# EAGLE design beemos-master (EAGLE 9.1.0)
DELETE: MF
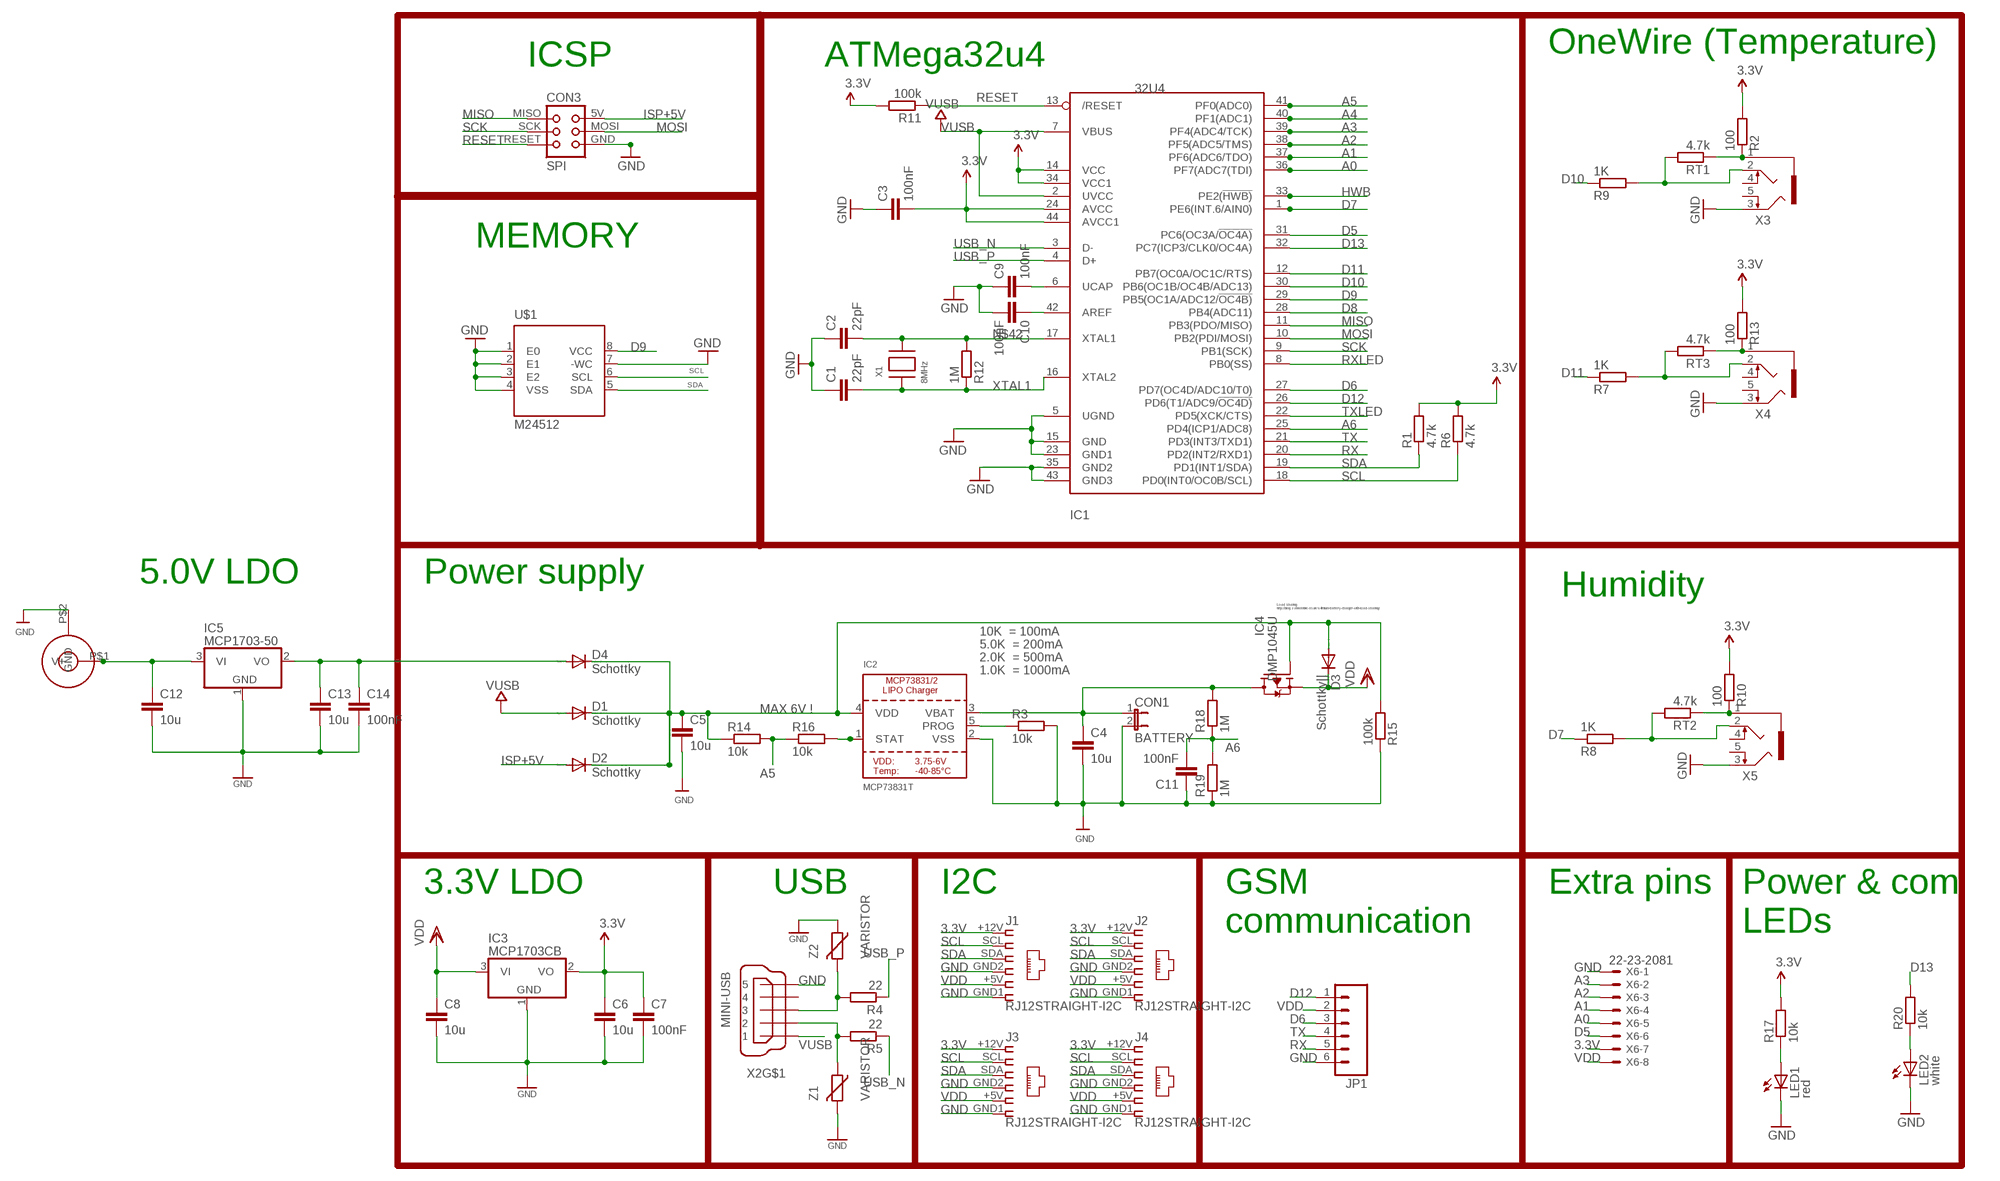
[diagram p0: schematic, sheet 1]

## Parts
C1  22pF  C-EUC0805K  [C0805K]
C2  22pF  C-EUC0805K  [C0805K]
C3  100nF  C-EUC0805K  [C0805K]
C4  10u  C-EUC0805K  [C0805K]
C5  10u  C-EUC0805K  [C0805K]
C6  10u  C-EUC0805K  [C0805K]
C7  100nF  C-EUC0805K  [C0805K]
C8  10u  C-EUC0805K  [C0805K]
C9  100nF  C-EUC0805K  [C0805K]
C10  100nF  C-EUC0805K  [C0805K]
C11  100nF  C-EUC0805K  [C0805K]
C12  10u  C-EUC0805K  [C0805K]
C13  10u  C-EUC0805K  [C0805K]
C14  100nF  C-EUC0805K  [C0805K]
CON1  BATTERY  JP1E  [JP1]
CON2  JACK_DC_BARREL  [DC_BARREL]
CON3  SPI  TINYISPT  [TC2030-MCP-NL]
D1  Schottky  MBR0520LT  [SOD123]
D2  Schottky  MBR0520LT  [SOD123]
D3  Schottky||  MBR0520LT  [SOD123]
D4  Schottky  MBR0520LT  [SOD123]
IC1  32U4  ATMEGA32U4-AU  [TQFP44]
IC2  MCP73831T  MCP73831/2  [SOT23-5]
IC3  MCP1703CB  [SOT23]
IC4  DMP1045U  TRANSISTOR_FET_TSM2301CX  [SOT-23]
IC5  MCP1703-50  MCP1703CB  [SOT23]
J1  RJ12STRAIGHT-I2C  [RJ12-STRAIGHT-I2C]
J2  RJ12STRAIGHT-I2C  [RJ12-STRAIGHT-I2C]
J3  RJ12STRAIGHT-I2C  [RJ12-STRAIGHT-I2C]
J4  RJ12STRAIGHT-I2C  [RJ12-STRAIGHT-I2C]
JP1  M06RA  [MOLEX-1X6-RA]
LED1  red  LEDCHIP-LED0805  [CHIP-LED0805]
LED2  white  LEDCHIP-LED0805  [CHIP-LED0805]
R1  4.7k  R-EU_R0805  [R0805]
R2  100  R-EU_R0805  [R0805]
R3  10k  R-EU_R0805  [R0805]
R4  22  R-EU_R0805  [R0805]
R5  22  R-EU_R0805  [R0805]
R6  4.7k  R-EU_R0805  [R0805]
R7  1K  R-EU_R0805  [R0805]
R8  1K  R-EU_R0805  [R0805]
R9  1K  R-EU_R0805  [R0805]
R10  100  R-EU_R0805  [R0805]
R11  100k  R-EU_R0805  [R0805]
R12  1M  R-EU_R0805  [R0805]
R13  100  R-EU_R0805  [R0805]
R14  10k  R-EU_R0805  [R0805]
R15  100k  R-EU_R0805  [R0805]
R16  10k  R-EU_R0805  [R0805]
R17  10k  R-EU_R0805  [R0805]
R18  1M  R-EU_R0805  [R0805]
R19  1M  R-EU_R0805  [R0805]
R20  10k  R-EU_R0805  [R0805]
RT1  4.7k  R-EU_R0805  [R0805]
RT2  4.7k  R-EU_R0805  [R0805]
RT3  4.7k  R-EU_R0805  [R0805]
U$1  M24512  [SO8]
X1  8MHz  XTALNX6035  [NX6035]
X2  MINI-USB  MINI-USB-SCHIELD-32005-201  [32005-201]
X3  1503_09  [1503_09]
X4  1503_09  [1503_09]
X5  1503_09  [1503_09]
X6  22-23-2081  [22-23-2081]
Z1  VARISTOR  VARISTORCN0805  [CT/CN0805]
Z2  VARISTOR  VARISTORCN0805  [CT/CN0805]

## Nets
3.3V [power]: C3.2 C6.1 C7.1 IC1.14(VCC) IC1.24(AVCC) IC1.34(VCC1) IC1.44(AVCC1) IC3.2(VO) J1.+12V J2.+12V J3.+12V J4.+12V R1.2 R2.2 R6.2 R10.2 R11.2 R13.2 R17.2 X6.7
A0: IC1.36(PF7(ADC7(TDI)) X6.5
A1: IC1.37(PF6(ADC6/TDO)) X6.4
A2: IC1.38(PF5(ADC5/TMS)) X6.3
A3: IC1.39(PF4(ADC4/TCK)) X6.2
A4: IC1.40(PF1(ADC1))
A5: IC1.41(PF0(ADC0)) R14.2 R16.1
A6: C11.2 IC1.25(PD4(ICP1/ADC8)) R18.1 R19.2
AREF: C10.1 IC1.42(AREF)
D5: IC1.31(PC6(OC3A/!OC4A)) X6.6
D6: IC1.27(PD7(OC4D/ADC10/T0)) JP1.3
D7: IC1.1(PE6(INT.6/AIN0)) R8.1
D8: IC1.28(PB4(ADC11))
D9: IC1.29(PB5(OC1A/ADC12/!OC4B)) U$1.8(VCC)
D10: IC1.30(PB6(OC1B/OC4B/ADC13)) R9.1
D11: IC1.12(PB7(OC0A/OC1C/RTS)) R7.1
D12: IC1.26(PD6(T1/ADC9/!OC4D)) JP1.1
D13: IC1.32(PC7(ICP3/CLK0/OC4A)) R20.2
GND [power]: C1.1 C2.1 C3.1 C4.2 C5.2 C6.2 C7.2 C8.2 C9.1 C10.2 C11.1 C12.2 C13.2 C14.2 CON1.2 CON2.P$2(GND) CON3.GND IC1.5(UGND) IC1.15(GND) IC1.23(GND1) IC1.35(GND2) IC1.43(GND3) IC2.2(VSS) IC3.1(GND) IC5.1(GND) J1.GND1 J1.GND2 J2.GND1 J2.GND2 J3.GND1 J3.GND2 J4.GND1 J4.GND2 JP1.6 LED1.C LED2.C R3.2 R15.1 R19.1 U$1.1(E0) U$1.2(E1) U$1.3(E2) U$1.4(VSS) U$1.7(-WC) X2.5 X3.3 X4.3 X5.3 X6.1 Z1.2 Z2.1
HWB: IC1.33(PE2(!HWB))
ISP+5V: CON3.5V(VCC) D2.A
MISO: CON3.MISO IC1.11(PB3(PDO/MISO))
MOSI: CON3.MOSI IC1.10(PB2(PDI/MOSI))
N$1: C9.2 IC1.6(UCAP)
N$2 [power]: R7.2 RT3.2 X4.2
N$3: C13.1 C14.1 D4.A IC5.2(VO)
N$4 [power]: R13.1 RT3.1 X4.1
N$5: C5.1 D1.C D2.C D3.A D4.C IC2.4(VDD) IC4.1(G) R14.1 R15.2
N$6: IC2.5(PROG) R3.1
N$7: IC2.1(STAT) R16.2
N$8 [power]: R8.2 RT2.2 X5.2
N$9 [power]: R10.1 RT2.1 X5.1
N$10: LED1.A R17.1
N$11: LED2.A R20.1
N$12 [power]: C12.1 CON2.P$1(V+) IC5.3(VI)
N$14 [power]: R2.1 RT1.1 X3.1
N$21 [power]: R9.2 RT1.2 X3.2
N$42: C2.2 IC1.17(XTAL1) R12.2 X1.P$2
RESET: CON3.RESET IC1.13(/RESET) R11.1
RX: IC1.20(PD2(INT2/RXD1)) JP1.5
RXLED: IC1.8(PB0(SS))
SCK: CON3.SCK IC1.9(PB1(SCK))
SCL: IC1.18(PD0(INT0/OC0B/SCL)) J1.SCL J2.SCL J3.SCL J4.SCL R6.1 U$1.6(SCL)
SDA: IC1.19(PD1(INT1/SDA)) J1.SDA J2.SDA J3.SDA J4.SDA R1.1 U$1.5(SDA)
TX: IC1.21(PD3(INT3/TXD1)) JP1.4
TXLED: IC1.22(PD5(XCK/CTS))
USB_N: IC1.3(D-) R5.1
USB_P: IC1.4(D+) R4.1
USBC_N: R5.2 X2.2 Z1.1
USBC_P: R4.2 X2.3 Z2.2
VBAT1: C4.1 CON1.1 IC2.3(VBAT) IC4.3(D) R18.2
VDD [power]: C8.1 D3.C IC3.3(VI) IC4.2(S) J1.+5V J2.+5V J3.+5V J4.+5V JP1.2 X6.8
VUSB: D1.A IC1.2(UVCC) IC1.7(VBUS) X2.1
XTAL1: C1.2 IC1.16(XTAL2) R12.1 X1.P$1
Unconnected: X2.4 X2.M1(S:S1) X2.M2(S:S2) X2.M3(S:S3) X2.M4(S:S4) X3.4 X3.5 X4.4 X4.5 X5.4 X5.5

## Notes on the sheet
- OneWire (Temperature)
- ICSP | ATMega32u4
- MEMORY
- 5.0V LDO | Power supply
- Humidity
- Load sharing:
  http://blog.zakkemble.co.uk/a-lithium-battery-charger-with-load-sharing/
- 10K  = 100mA
- 5.0K  = 200mA
- 2.0K  = 500mA
- 1.0K  = 1000mA
- MAX 6V !
- 3.3V LDO | USB | I2C | Extra pins
- GSM 
  communication
- Power & com 
  LEDs

## Library data of the parts
C1 C2 = rcl:C-EU: CAPACITOR, European symbol; ELECROW: C1797; LCSC: C1797; MPN: 77-VJ1206A180JXXPBC; SPICEPREFIX: C
C3 C7 C9-C11 C14 = rcl:C-EU: CAPACITOR, European symbol; ELECROW: C49678; LCSC: C49678; MPN: 80-C1206C104K5R; SPICEPREFIX: C
C4-C6 C8 C12 C13 = rcl:C-EU: CAPACITOR, European symbol; ELECROW: C15850; LCSC: C15850; MPN: 77-VJ1206V106ZXQTBC; SPICEPREFIX: C
CON1 = jumper:JP1E: JUMPER
CON2 = lpatiny:JACK_DC_BARREL
CON3 = lpatiny:TINYISP: CONNECTOR
D1-D4 = diode:MBR0520LT: SCHOTTKY BARRIER RECTIFIER Source: http://onsemi.com .. MBR0520LT1-D.pdf; LCSC: C82544; MPN: 621-1N5819HW-F
IC1 = adafruit:ATMEGA32U4: http://www.ladyada.net/library/eagle; LCSC: C44854; MPN: 556-ATMEGA32U4RC-AU
IC2 = microbuilder:MCP73831/2: MCP73831/2 LIPO Charger VDD: 3.75 - 6V Temp -40 - 85°C Programmable Charge Rate: 15-500mA NOTE: STAT is a tri-state logic output on the MCP73831 and an open-drain output on the MCP73832. SOT23-5 with 4.2V output and tri-state logic on STAT = MCP73831T-2ACI/OT; LCSC: C14879; MPN: 579-MCP73831T-3ACIOT
IC3 = linear:MCP1703: 250 mA, 16V, Low Quiescent Current LDO Regulator Source: http://ww1.microchip.com/downloads/en/DeviceDoc/22049b.pdf; LCSC: C53352
IC4 = dp_devices:TRANSISTOR_FET_TSM2301CX: 20V P-Channel Enhancement Mode MOSFET; LCSC: C96613; MPN: 621-DMP1045U-7
IC5 = linear:MCP1703: 250 mA, 16V, Low Quiescent Current LDO Regulator Source: http://ww1.microchip.com/downloads/en/DeviceDoc/22049b.pdf
J1-J4 = lpatiny:RJ12: CORCOM Modular RJ Jacks No Shield Source: www.tycoelectronics.com .. ENG_DS_1654001_1099_RJ_L_0507.pdf
JP1 = SparkFun:M06: Header 6 Standard 6-pin 0.1" header. Use with straight break away headers (SKU : PRT-00116), right angle break away headers (PRT-00553), swiss pins (PRT-00743), machine pins (PRT-00117), and female headers (PRT-00115). Molex polarized connector foot print use with SKU : PRT-08094 with associated crimp pins and housings. NOTES ON THE VARIANTS LOCK and LOCK_LONGPADS... This footprint was designed to help hold the alignment of a through-hole component (i.e. 6-pin header) while soldering it into place. You may notice that each hole has been shifted either up or down by 0.005 of an inch from it's more standard position (which is a perfectly straight line). This slight alteration caused the pins (the squares in the middle) to touch the edges of the holes. Because they are alternating, it causes a "brace" to hold the component in place. 0.005 has proven to be the perfect amount of "off-center" position when using our standard breakaway headers. Although looks a little odd when you look at the bare footprint, once you have a header in there, the alteration is very hard to notice. Also, if you push a header all the way into place, it is covered up entirely on the bottom side. This idea of altering the position of holes to aid alignment will be further integrated into the Sparkfun Library for other footprints. It can help hold any component with 3 or more connection pins.
LED1 LED2 = led:LED: LED OSRAM: - CHIPLED LG R971, LG N971, LY N971, LG Q971, LY Q971, LO R971, LY R971 LH N974, LH R974 LS Q976, LO Q976, LY Q976 LO Q996 - Hyper CHIPLED LW Q18S LB Q993, LB Q99A, LB R99A - SideLED LS A670, LO A670, LY A670, LG A670, LP A670 LB A673, LV A673, LT A673, LW A673 LH A674 LY A675 LS A676, LA A676, LO A676, LY A676, LW A676 LS A679, LY A679, LG A679 - Hyper Micro SIDELED® LS Y876, LA Y876, LO Y876, LY Y876 LT Y87S - SmartLED LW L88C, LW L88S LB L89C, LB L89S, LG L890 LS L89K, LO L89K, LY L89K LS L896, LA L896, LO L896, LY L896 - TOPLED LS T670, LO T670, LY T670, LG T670, LP T670 LSG T670, LSP T670, LSY T670, LOP T670, LYG T670 LG T671, LOG T671, LSG T671 LB T673, LV T673, LT T673, LW T673 LH T674 LS T676, LA T676, LO T676, LY T676, LB T676, LH T676, LSB T676, LW T676 LB T67C, LV T67C, LT T67C, LS T67K, LO T67K, LY T67K, LW E67C LS E67B, LA E67B, LO E67B, LY E67B, LB E67C, LV E67C, LT E67C LW T67C LS T679, LY T679, LG T679 LS T770, LO T770, LY T770, LG T770, LP T770 LB T773, LV T773, LT T773, LW T773 LH T774 LS E675, LA E675, LY E675, LS T675 LS T776, LA T776, LO T776, LY T776, LB T776 LHGB T686 LT T68C, LB T68C - Hyper Mini TOPLED® LB M676 - Mini TOPLED Santana® LG M470 LS M47K, LO M47K, LY M47K Source: http://www.osram.convergy.de LUXEON: - LUMILED® LXK2-PW12-R00, LXK2-PW12-S00, LXK2-PW14-U00, LXK2-PW14-V00 LXK2-PM12-R00, LXK2-PM12-S00, LXK2-PM14-U00 LXK2-PE12-Q00, LXK2-PE12-R00, LXK2-PE12-S00, LXK2-PE14-T00, LXK2-PE14-U00 LXK2-PB12-K00, LXK2-PB12-L00, LXK2-PB12-M00, LXK2-PB14-N00, LXK2-PB14-P00, LXK2-PB14-Q00 LXK2-PR12-L00, LXK2-PR12-M00, LXK2-PR14-Q00, LXK2-PR14-R00 LXK2-PD12-Q00, LXK2-PD12-R00, LXK2-PD12-S00 LXK2-PH12-R00, LXK2-PH12-S00 LXK2-PL12-P00, LXK2-PL12-Q00, LXK2-PL12-R00 Source: www.luxeon.com KINGBRIGHT: KA-3528ASYC Source: www.kingbright.com
R1 R2 R6-R10 R13 = rcl:R-EU_: RESISTOR, European symbol
R3 = rcl:R-EU_: RESISTOR, European symbol; ELECROW: C17414; LCSC: C17414
R4 = rcl:R-EU_: RESISTOR, European symbol; ELECROW: C17561; LCSC: C17561
R5 = rcl:R-EU_: RESISTOR, European symbol; ELECROW: C17561; LCSC: C17561; SPICEPREFIX: R
R11 = rcl:R-EU_: RESISTOR, European symbol; ELECROW: C17407; LCSC: C17407; MPN: RC1206FR-07100KL; SPICEPREFIX: R
R12 R18 R19 = rcl:R-EU_: RESISTOR, European symbol; ELECROW: C17514; LCSC: C17514
R14 R16 = rcl:R-EU_: RESISTOR, European symbol; ELECROW: C17513; LCSC: C17513
R15 = rcl:R-EU_: RESISTOR, European symbol; ELECROW: C17407; LCSC: C17407; MPN: RC1206FR-07100KL
R17 R20 = rcl:R-EU_: RESISTOR, European symbol; SPICEPREFIX: R
RT1-RT3 = resistor:R-EU_: RESISTOR, European symbol
U$1 = lpatiny:M24512
X1 = lpatiny:XTAL: Low cost SMT crystals, no capacitors included http://www.ladyada.net/library/eagle; LCSC: C122522; MPN: 729-F60800010
X2 = con-cypressindustries:MINI-USB-SCHIELD-: MINI USB-B Conector Source: www.cypressindustries.com; LCSC: C46391; MPN: 649-10033526-N3212LF
X3-X5 = con-lumberg:1503_09: Jack connectors according to JISC 6560, 3.5 mm Klinkeneinbaukupplung nach JISC 6560, 3,5 mm, 3-polig/ stereo, abgewinkelte Ausführung, mit 2 Öffnern und Lötaugen, für Leiterplatten Rückseitenmontage Source: http://www.lumberg.com/Produkte/PDFs/1503_09.pdf; OC_FARNELL: 1243244; OC_NEWARK: unknown
X6 = con-molex:22-23-2081: .100" (2.54mm) Center Header - 8 Pin; MF: MOLEX; MPN: 22-23-2081; OC_FARNELL: 1756826; OC_NEWARK: 01C7592
Z1 Z2 = varistor:VARISTOR: VARISTOR; LCSC: C79709

## Net classes
0 default: width 0.203 mm, clearance 0.25 mm
1 power: width 0.203 mm, drill 0.305 mm, clearance 0.25 mm
2 VIN: width 0.406 mm, clearance 0.25 mm
3 fine: width 0.406 mm, clearance 0.25 mm
4 aref: width 0.406 mm, clearance 0.25 mm

## Board
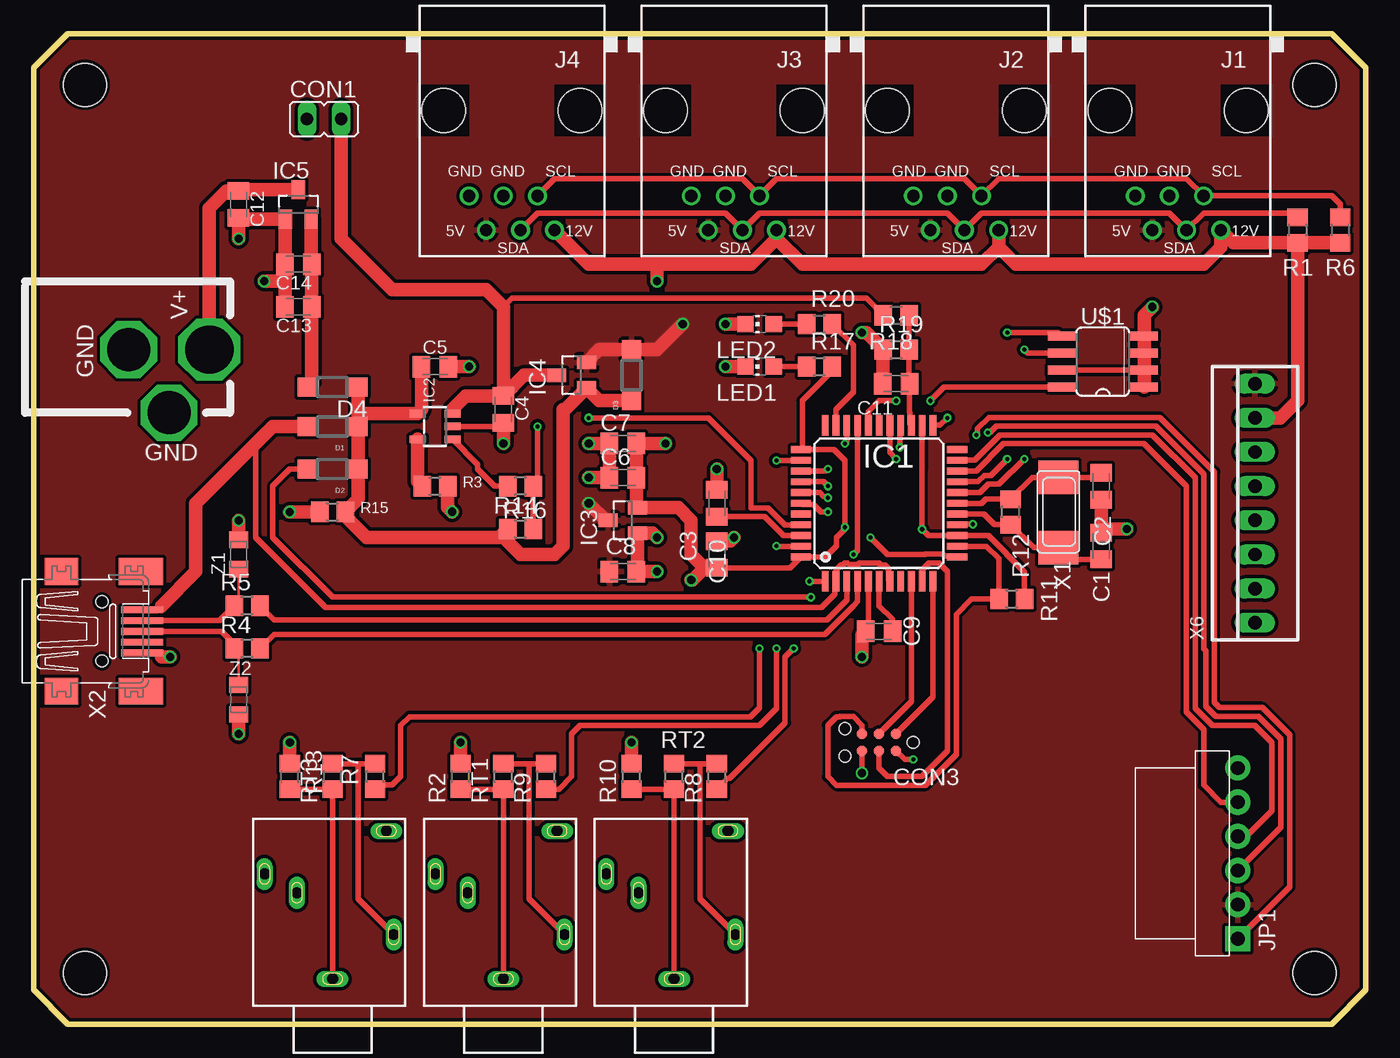
[diagram p1: board, top side]
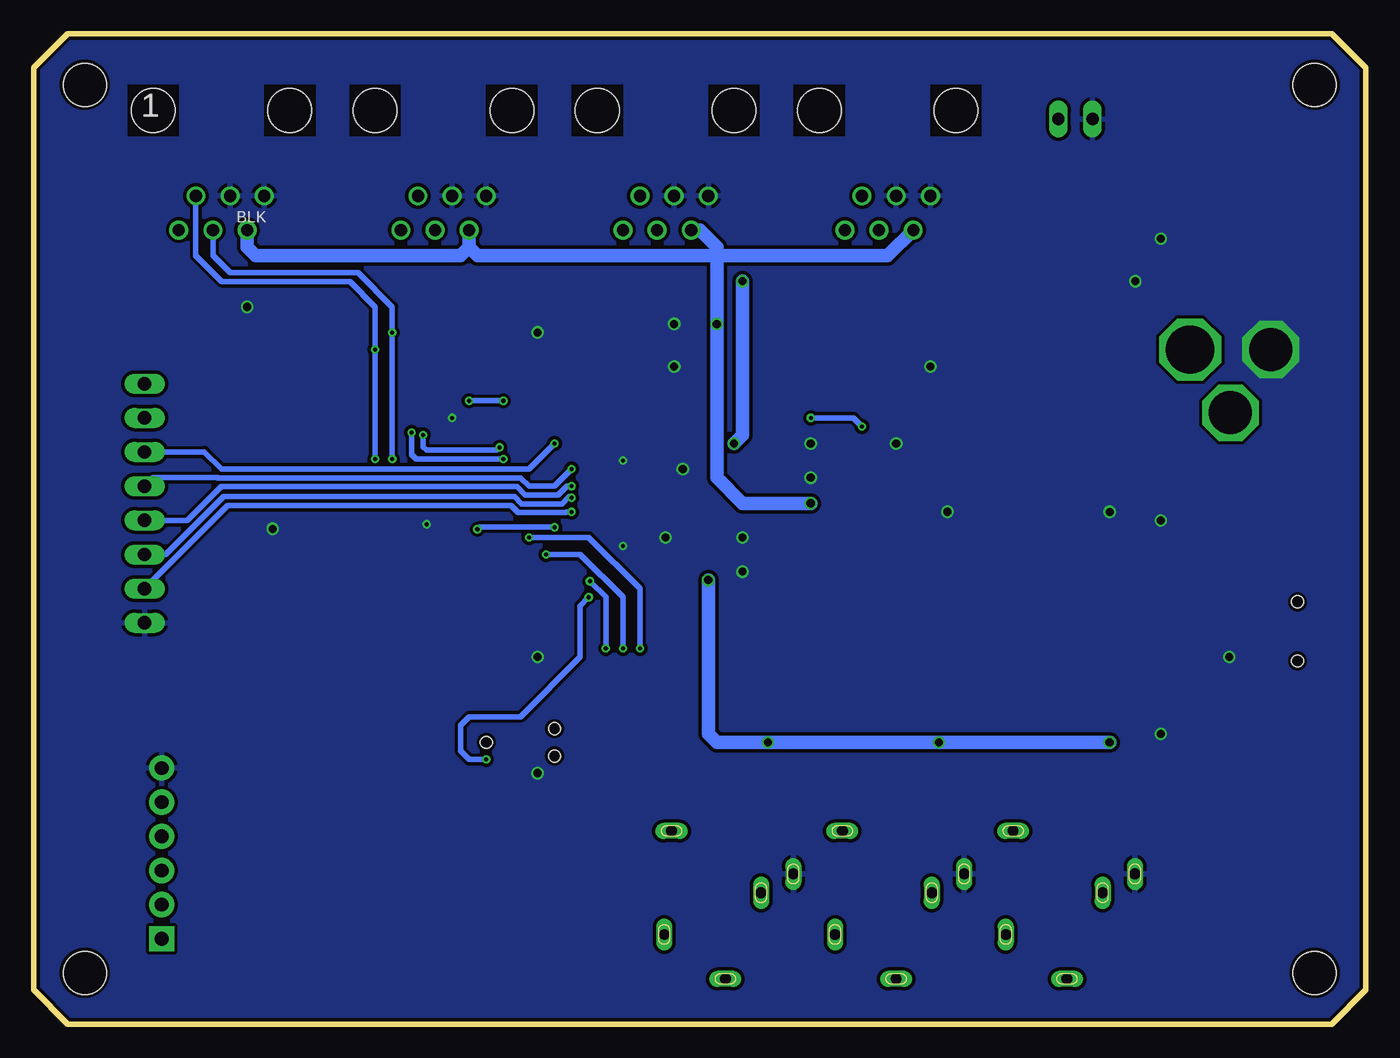
[diagram p2: board, bottom side, seen from below]

Size 99.06 x 73.66 mm. Coordinates in mm from the lower left corner, seen from the top.
Outline: 99.06,71.12 99.06,2.54 96.52,0 2.54,0 0,2.54 0,71.12 2.54,73.66 96.52,73.66 99.06,71.12
Copper layers (1*16): Top 0.035mm / dielectric 0.2mm / Bottom 0.035mm
Design rules "SeeedStudio_DRU_no_angle_20130527 *": minimum track width 6mil, minimum drill 12mil, track to track 6mil, track to pad 6mil, pad to pad 6mil, via to via 6mil, smd to smd 0mil, copper to edge 10mil, drill to drill 10mil, minimum pad ring 6mil, minimum via ring 6mil, stop-mask expansion 2mil, vias tented up to drill 25mil, thermal gap 10mil
Holes 3.2 mm at 95.25,69.85 95.25,3.81 3.81,69.85 3.81,3.81

### Footprints (pad centres in the part's own frame; a part is rotated, then mirrored left to right if it is on the bottom)
C0805K = smd 1.3 x 1.6: 1 -1,0; 2 1,0
JP1 = drill 0.914 long: 1 0,-1.27; 2 0,1.27
DC_BARREL = drill 3.6 pad 4.5 octagon: P$1 0,13.7 | drill 3.2 pad 4.064 octagon: P$2 0,7.7; P$3 4.7,10.7
TC2030-MCP-NL = smd 0.787 x 0.787: 5V 1.27,0.635; GND 3.81,0.635; MISO 1.27,-0.635; MOSI 2.54,0.635; RESET 3.81,-0.635; SCK 2.54,-0.635 | hole 0.889: 0,0; 5.08,-1.016; 5.08,1.016
SOD123 = smd 1.4 x 1.4: A 1.9,0; C -1.9,0
TQFP44 = smd 1.5 x 0.5: 1 -5.8,4; 2 -5.8,3.2; 3 -5.8,2.4; 4 -5.8,1.6; 5 -5.8,0.8; 6 -5.8,0; 7 -5.8,-0.8; 8 -5.8,-1.6; 9 -5.8,-2.4; 10 -5.8,-3.2; 11 -5.8,-4; 23 5.8,-4; 24 5.8,-3.2; 25 5.8,-2.4; 26 5.8,-1.6; 27 5.8,-0.8; 28 5.8,0; 29 5.8,0.8; 30 5.8,1.6; 31 5.8,2.4; 32 5.8,3.2; 33 5.8,4 | smd 0.5 x 1.5: 12 -4,-5.8; 13 -3.2,-5.8; 14 -2.4,-5.8; 15 -1.6,-5.8; 16 -0.8,-5.8; 17 0,-5.8; 18 0.8,-5.8; 19 1.6,-5.8; 20 2.4,-5.8; 21 3.2,-5.8; 22 4,-5.8; 34 4,5.8; 35 3.2,5.8; 36 2.4,5.8; 37 1.6,5.8; 38 0.8,5.8; 39 0,5.8; 40 -0.8,5.8; 41 -1.6,5.8; 42 -2.4,5.8; 43 -3.2,5.8; 44 -4,5.8
SOT23-5 = smd 0.55 x 1.2: 1 -0.95,-1.3; 2 0,-1.3; 3 0.95,-1.3; 4 0.95,1.3; 5 -0.95,1.3
SOT23 = smd 1 x 1.4: 1 -0.95,-1.1; 2 0.95,-1.1; 3 0,1.1
SOT-23 = smd 1 x 1.4: 1 -0.95,-1.1; 2 0.95,-1.1; 3 0,1.1
RJ12-STRAIGHT-I2C = drill 0.9 pad 1.4: +5V 1.905,8.89; +12V -3.175,8.89; GND1 3.175,6.35; GND2 0.635,6.35; SCL -1.905,6.35; SDA -0.635,8.89 | hole 3.251: -5.08,0; 5.08,0
MOLEX-1X6-RA = drill 1.016 pad 1.88 square: 1 0,0 | drill 1.016 pad 1.88: 2 2.54,0; 3 5.08,0; 4 7.62,0; 5 10.16,0; 6 12.7,0
CHIP-LED0805 = smd 1.2 x 1.2: A 0,-1.05; C 0,1.05
R0805 = smd 1.3 x 1.5: 1 -0.95,0; 2 0.95,0
SO8 = smd 0.66 x 2.032: 1 -3.81,-3.073; 2 -2.54,-3.073; 3 -1.27,-3.073; 4 0,-3.073; 5 0,3.073; 6 -1.27,3.073; 7 -2.54,3.073; 8 -3.81,3.073
NX6035 = smd 2.5 x 3: P$1 2.665,0; P$2 -2.565,0
32005-201 = smd 3.1 x 0.5: 1 3,1.6; 2 3,0.8; 3 3,0; 4 3,-0.8; 5 3,-1.6 | smd 2.5 x 2: M1 -3,-4.45; M2 -3,4.45 | smd 3.3 x 2: M3 2.9,4.45; M4 2.9,-4.45 | hole 0.9: 0,2.2; 0,-2.2
1503_09 = drill 0.8 pad 1.2 long: 1 0,-2.1; 2 -4.55,-5.4; 3 5.05,-9.9; 4 -4,-13.1; 5 2.65,-8.5
22-23-2081 = drill 1 long: 1 -8.89,0; 2 -6.35,0; 3 -3.81,0; 4 -1.27,0; 5 1.27,0; 6 3.81,0; 7 6.35,0; 8 8.89,0
CT/CN0805 = smd 1.2 x 1.4: 1 -1.1,0; 2 1.1,0

### Placement (x,y rotation side)
C1  79.38,35.56 270 top
C2  79.38,40.01 90 top
C3  50.8,34.92 270 top
C4  34.92,45.72 270 top
C5  29.84,48.9 0 top
C6  43.81,40.64 180 top
C7  43.81,43.18 180 top
C8  43.81,33.66 0 top
C9  62.87,29.21 0 top
C10  50.8,38.73 90 top
C11  64.14,47.62 0 top
C12  15.24,60.96 270 top
C13  19.68,53.34 180 top
C14  19.68,56.52 180 top
CON1  21.59,67.31 90 top
CON2  -0.64,50.16 270 top
CON3  65.41,20.95 180 top
D1  22.23,44.45 180 top
D2  22.23,41.27 180 top
D3  44.45,48.26 270 top
D4  22.23,47.37 180 top
IC1  62.87,38.73 90 top
IC2  29.84,44.45 90 top
IC3  43.81,37.47 90 top
IC4  40.01,48.26 90 top
IC5  19.68,60.96 0 top
J1  85.09,67.94 180 top
J2  68.58,67.94 180 top
J3  52.07,67.94 180 top
J4  35.56,67.94 180 top
JP1  89.53,6.35 90 top
LED1  53.98,48.9 90 top
LED2  53.98,52.07 90 top
R1  93.98,59.05 270 top
R2  31.75,18.41 90 top
R3  29.84,40.01 0 top
R4  15.88,27.94 180 top
R5  15.88,31.11 180 top
R6  97.16,59.05 270 top
R7  25.4,18.41 90 top
R8  50.8,18.41 90 top
R9  38.1,18.41 90 top
R10  44.45,18.41 90 top
R11  72.73,31.62 0 top
R12  72.64,38.1 90 top
R13  19.05,18.41 90 top
R14  36.2,36.83 0 top
R15  22.23,38.1 0 top
R16  36.2,40.01 180 top
R17  58.42,48.9 0 top
R18  64.14,52.7 180 top
R19  64.14,50.16 0 top
R20  58.42,52.07 0 top
RT1  34.92,18.41 90 top
RT2  47.62,18.41 90 top
RT3  22.23,18.41 90 top
U$1  79.5,51.18 90 top
X1  76.2,38.1 270 top
X2  5.08,29.21 0 top
X3  34.92,1.27 180 top
X4  22.23,1.27 180 top
X5  47.62,1.27 180 top
X6  90.81,38.73 90 top
Z1  15.24,34.92 90 top
Z2  15.24,24.13 90 top

### Tracks (layer width: path | path; a pad name or v marks a point on that pad's centre or on a via)
3.3V  (via drill 0.3, 0.61)
  Top 0.406: R11.2 73.68,33.63 70.98,36.34 IC1.14 66.53,36.34 v66.06,36.8 66.06,41.27 | R17.2 59.37,48.58 57.15,46.35 57.15,42.82 IC1.34 59.5,42.73 60.33,41.91 v60.33,36.95 | 66.06,41.27 IC1.24 66.06,41.27 | 60.35,36.8 60.33,36.83 | 60.33,36.83 59.69,36.2 59.69,35.56 58.87,34.73 IC1.44 56.26,33.92 C3.2 | 60.35,36.8 60.33,36.83 | 60.33,36.83 v60.33,36.95 | 60.35,36.8 60.33,36.83 | 60.33,36.83 v60.33,36.95
  Top 1.016: J4.+12V 41.27,56.52 46.35,56.52 | 46.35,56.52 53.34,56.52 55.24,58.42 | 55.24,58.42 J3.+12V 55.24,58.42 | 55.24,58.42 57.15,56.52 70.48,56.52 71.75,57.78 | 71.75,57.78 J2.+12V 71.75,57.78 | 71.75,57.78 73.03,56.52 87,56.52 88.27,57.78 J1.+12V 89.22,58.1 R1.2 | R1.2 R6.2 | R1.2 93.98,46.35 92.71,45.09 X6.7 | 49.9,33.92 49.21,34.61 48.9,34.92 48.9,37.47 47.95,38.41 IC3.2 44.81,38.52 C6.1 C7.1 v46.99,43.18 | 49.9,33.92 C3.2 | 49.9,33.92 | 49.9,33.92 48.99,33.02 v48.9,33.02 | v44.45,20.95 R10.2 | v31.75,20.95 R2.2 | v19.05,20.95 R13.2 | 46.35,56.52 v46.35,55.24
  Bottom 0.406: v60.33,36.95 65.92,36.95 v66.06,36.8
  Bottom 1.016: v48.9,33.02 48.9,21.59 48.26,20.95 v44.45,20.95 v31.75,20.95 v19.05,20.95 | v46.35,55.24 46.35,43.81 v46.99,43.18
A0  (via drill 0.3)
  Top 0.406: v59.05,41.27 58.91,41.13 IC1.36
  Bottom 0.406: X6.5 90.17,40.64 85.38,40.64 85.36,40.62 62.84,40.62 62.23,40.01 60.33,40.01 v59.05,41.27
A1  (via drill 0.3)
  Top 0.406: IC1.37 58.73,40.34 v59.05,40.01
  Bottom 0.406: X6.4 87.63,37.47 85.13,39.96 63.12,39.96 62.5,39.35 60.05,39.35 59.4,40.01 v59.05,40.01
A2  (via drill 0.3)
  Top 0.406: v59.05,39.15 58.95,39.25 58.74,39.25 58.45,39.53 IC1.38
  Bottom 0.406: X6.3 89.24,34.92 84.94,39.22 63.3,39.22 62.77,38.69 59.78,38.69 59.25,39.22 59.13,39.22 v59.05,39.15
A3  (via drill 0.3)
  Top 0.406: IC1.39 57.16,38.64 58,38.64 58.54,38.1 v59.05,38.1
  Bottom 0.406: X6.2 84.62,38.57 63.58,38.57 63.05,38.04 59.51,38.04 59.45,38.1 v59.05,38.1
A5  (via drill 0.3)
  Top 0.406: R14.2 R16.1 37.47,40.33 v37.47,44.45 | v41.27,45.09 50.16,45.09 53.34,41.91 53.34,38.39 54.61,38.39 55.87,37.13 IC1.41
  Bottom 0.406: v37.47,44.45 38.1,45.09 v41.27,45.09
A6
  Top 0.406: R18.1 R19.2 65.08,47.67 C11.2 65.14,45.51 65.17,45.47 65.17,44.63 IC1.25
AREF
  Top 0.406: IC1.42 55.74,36.34 54.34,37.73 C10.1
D5  (via drill 0.3)
  Top 0.406: IC1.31 60.47,43.32 v60.33,43.18
  Bottom 0.406: X6.6 86.36,42.55 85.09,41.27 62.23,41.27 v60.33,43.18
D6  (via drill 0.3)
  Top 0.406: JP1.3 92.73,14.63 92.73,21.23 91.08,22.88 87.9,22.88 87.14,23.64 87.14,27.79 87.02,27.92 87.02,40.91 83.46,44.47 73.66,44.47 | 73.39,44.47 73.66,44.47 | v64.14,42.03 63.66,42.5 IC1.27 | 73.66,44.47 73.39,44.47 | 73.39,44.47 71.58,44.47 71.09,43.98 v70.95,43.98
  Bottom 0.406: v64.14,42.03 70.61,42.03 70.95,42.38 v70.95,43.98
D7  (via drill 0.3)
  Top 0.406: R8.1 51.6,18.26 51.74,18.26 55.88,22.4 55.88,27.3 v56.52,27.94 | v57.7,32.94 IC1.1
  Bottom 0.406: v56.52,27.94 56.52,31.75 v57.7,32.94
D9  (via drill 0.3)
  Top 0.406: U$1.8 67.69,47.37 v66.67,46.35 | v64.14,46.35 62.87,46.35 62.06,45.55 IC1.29
  Bottom 0.406: v66.67,46.35 v64.14,46.35
D10  (via drill 0.3)
  Top 0.406: R9.1 39.05,17.46 40.01,18.41 40.01,21.59 40.62,22.2 53.95,22.2 55.22,23.47 55.22,27.58 55.24,27.6 v55.24,27.94 | IC1.30 61.27,35.23 v60.96,34.92
  Bottom 0.406: v55.24,27.94 55.24,31.75 58.42,34.92 v60.96,34.92
D11  (via drill 0.3)
  Top 0.406: R7.1 25.71,17.78 26.67,17.78 27.3,18.41 27.3,22.23 27.94,22.86 53.32,22.86 53.98,23.52 v53.98,27.94 | v62.23,36.2 63.5,34.92 66.29,34.92 66.31,34.95 67.61,34.95 67.73,34.83 68.57,34.83 IC1.12
  Bottom 0.406: v53.98,27.94 53.98,32.38 57.78,36.2 v62.23,36.2
D12  (via drill 0.3)
  Top 0.406: JP1.1 93.39,10.2 93.39,21.5 91.35,23.54 88.17,23.54 87.8,23.91 87.8,41.06 83.73,45.13 71.02,45.13 70.19,44.3 70.19,43.92 v70.09,43.81 | v64.42,42.89 64.42,44.49 IC1.26
  Bottom 0.406: v64.42,42.89 64.63,42.69 69.85,42.69 70.09,42.93 v70.09,43.81
D13
  Top 0.406: R20.2 60.96,50.48 60.96,46.99 59.66,45.7 IC1.32
GND  (via drill 0.3, 0.6, 0.61)
  Top 0.203: 62.06,29.41 62.05,29.39 C9.1
  Top 0.406: C4.2 34.66,44.45 IC2.2 | CON3.GND v61.59,18.67 | IC1.35 57.04,41.91 v55.24,41.91 | IC1.43 55.27,35.53 v55.24,35.56 | IC1.23 67.39,44.53 v67.94,45.09 | IC1.15 68.71,37.18 v69.85,37.18 | IC1.5 62.06,29.41 62.05,29.39 | U$1.7 U$1.2
  Top 0.508: X2.5 9.22,27.61 9.53,27.3
  Top 1.016: 9.53,27.3 v10.16,27.3 | Z2.1 v15.24,21.59 | Z1.2 v15.24,37.47 | C5.2 v32.38,48.9 | C4.2 v34.92,43.18 | R15.1 v19.05,38.1 | v46.35,33.66 C8.2 44.91,33.76 IC3.1 46.03,36.52 v46.35,36.2 | C10.2 v50.8,41.27 | v41.27,43.18 C7.2 C6.2 v41.27,40.64 | LED1.C v51.44,48.9 | LED2.C v51.44,52.07 | v81.28,36.83 79.9,36.83 C1.1 C2.1 | v61.59,27.3 61.59,28.94 C9.1 | U$1.1 U$1.2 U$1.3 U$1.4 82.58,52.73 v83.19,53.34 | C13.2 18.68,55.24 | 18.68,55.24 C14.2 18.68,59.81 IC5.1 17.14,59.86 15.34,59.86 C12.2 v15.24,58.42 | 18.68,55.24 v17.14,55.24 | R3.2 30.8,38.42 v31.11,38.1 | C11.1 63.13,50.12 R19.1 61.91,51.44 v61.59,51.44 | C3.1 51.8,35.92 v52.07,36.2
  pour Bottom: 0,71.12 2.54,73.66 96.52,73.66 99.06,71.12 99.06,2.54 96.52,0 2.54,0 0,2.54 0,70.48
ISP+5V  (via drill 0.3)
  Top 0.406: D2.A 19.05,41.27 17.78,40.01 17.78,36.2 22.23,31.75 v57.78,31.75 | v65.41,19.68 64.77,19.68 CON3.5V
  Bottom 0.406: v57.78,31.75 58.42,31.11 58.42,27.3 62.87,22.86 66.67,22.86 67.31,22.23 67.31,20.32 66.67,19.68 v65.41,19.68
MISO
  Top 0.406: CON3.MISO 66.86,24.32 IC1.11
MOSI
  Top 0.406: CON3.MOSI 62.87,19.05 63.5,18.41 66.04,18.41 67.94,20.32 67.94,33.66 67.31,34.29 66.58,34.29 66.06,33.78 IC1.10
N$1
  Top 0.406: C9.2 63.87,30.11 62.87,31.11 IC1.6
N$2
  Top 0.406: R7.2 24.13,19.36 | 24.13,19.36 RT3.2 | X4.2 24.13,9.31 24.13,19.36
N$3
  Top 1.016: IC5.2 20.64,56.56 C14.1 C13.1 20.68,47.73 D4.A
N$4
  Top 0.406: R13.1 RT3.1 X4.1
N$5
  Top 1.016: D4.C 24.12,45.09 | 24.12,45.09 D2.C D1.C 24.12,39.05 R15.2 23.18,37.78 24.77,36.2 34.61,36.2 R14.1 35.24,35.88 36.2,34.92 38.73,34.92 39.37,35.56 39.37,45.72 39.52,45.72 IC4.1 42.05,46.36 D3.A | C5.1 28.84,45.7 IC2.4 24.44,45.4 24.12,45.09
N$6
  Top 1.016: R3.1 28.55,40.35 IC2.5
N$7
  Top 0.406: IC2.1 33.02,41.62 33.02,41.27 34.29,40.01 R16.2
N$8
  Top 0.406: R8.2 49.53,19.36 | 49.53,19.36 RT2.2 | X5.2 49.53,9.31 49.53,19.36
N$9
  Top 0.406: R10.1 RT2.1 X5.1
N$10
  Top 0.406: LED1.A R17.1
N$11
  Top 0.406: LED2.A R20.1
N$12
  Top 1.016: CON2.P$1 13.06,60.69 14.34,61.96 C12.1 15.34,62.06 IC5.3
N$14
  Top 0.406: R2.1 RT1.1 X3.1
N$21
  Top 0.406: R9.2 36.83,19.36 | 36.83,19.36 RT1.2 | X3.2 36.83,9.31 36.83,19.36
N$42
  Top 0.406: IC1.17 70.48,38.73 70.8,39.05 R12.2 74.26,40.66 X1.P$2 79.03,40.66 C2.2
RESET
  Top 0.406: IC1.13 70.85,35.53 71.75,34.63 71.75,31.65 R11.1 69.74,31.62 68.6,30.48 68.6,20.05 66.31,17.76 59.71,17.76 59.05,18.41 59.05,22.23 59.69,22.86 59.94,22.86 59.95,22.87 60.95,22.87 61.59,22.23 CON3.RESET
RX
  Top 0.406: JP1.5 88.27,16.51 87,17.78 87,21.93 85.7,23.22 85.7,40.01 82.55,43.16 74.3,43.16 72.12,43.16 70.1,41.13 IC1.20
SCK
  Top 0.406: CON3.SCK 65.27,23.99 IC1.9
SCL  (via drill 0.3)
  Top 0.406: J4.SCL 38.73,62.87 52.7,62.87 J3.SCL 55.24,62.87 69.22,62.87 J2.SCL 71.75,62.87 85.72,62.87 J1.SCL 96.52,61.59 97.16,60.96 R6.1 | IC1.18 70.36,39.53 70.97,40.15 71.78,40.15 v73.66,42.03 | U$1.6 73.91,49.91 v73.66,50.16
  Bottom 0.406: v73.66,42.03 v73.66,50.16 73.66,53.34 | 73.66,53.34 | J1.SCL 87,57.15 85.07,55.22 75.54,55.22 73.66,53.34
SDA  (via drill 0.3)
  Top 0.406: J4.SDA 37.47,60.33 51.44,60.33 J3.SDA 53.98,60.33 67.94,60.33 J2.SDA 70.48,60.33 84.45,60.33 J1.SDA 87,60.33 93.66,60.33 R1.1 | IC1.19 70.23,40.34 70.7,40.81 71.17,40.81 v72.39,42.03 | U$1.5 76.17,51.44 v72.39,51.44
  Bottom 0.406: v72.39,42.03 v72.39,51.44 72.39,53.34 74.93,55.88 84.45,55.88 85.72,57.15 J1.SDA
TX
  Top 0.406: JP1.4 90.17,13.97 92.08,15.88 92.08,20.95 90.81,22.23 87.63,22.23 86.36,23.5 86.36,40.64 83.19,43.81 74.3,43.81 71.85,43.81 69.97,41.94 IC1.21
USB_N
  Top 0.406: R5.1 17.87,30.07 58.99,30.07 60.47,31.55 IC1.3
USB_P
  Top 0.406: R4.1 17.87,28.98 58.42,28.98 | 58.42,28.98 | 58.42,28.98 58.83,28.98 | 60.96,31.11 61.27,31.42 IC1.4 | 60.96,31.11 | 58.83,28.98 | 58.83,28.98 60.96,31.11
USBC_N
  Top 0.203: Z1.1 15.24,31.43 R5.2
  Top 0.406: X2.2 13.82,30.01 R5.2
USBC_P
  Top 0.203: Z2.2 15.24,27.62 R4.2
  Top 0.406: X2.3 13.97,29.21 15.24,27.94 R4.2
VBAT1
  Top 0.406: 31.11,45.72 31.14,45.69 IC2.3 | R18.2 61.91,53.98 35.56,53.98 34.92,53.34
  Top 1.016: C4.1 32.12,46.72 31.11,45.72 | C4.1 36.47,48.26 38.1,48.26 IC4.3 | CON1.1 22.86,58.42 26.67,54.61 33.66,54.61 34.92,53.34 C4.1
VDD  (via drill 0.61)
  Top 1.016: IC4.2 42.05,50.16 D3.C 46.35,50.16 v48.26,52.07 | v41.27,38.73 42.55,37.47 IC3.3
  Bottom 1.016: 48.26,57.15 v48.26,52.07 48.26,40.64 46.35,38.73 v41.27,38.73 | 48.26,57.15 48.26,57.78 49.53,59.05 | 49.53,59.05 J3.+5V 49.53,59.05 | J4.+5V 35.56,57.15 48.26,57.15 | 66.67,57.78 J2.+5V 66.67,57.78 | 66.67,57.78 66.04,57.15 48.26,57.15 | 66.67,57.78 67.31,57.15 82.55,57.15 83.19,57.78 J1.+5V
  pour Top: 0,71.12 2.54,73.66 96.52,73.66 99.06,71.12 99.06,2.54 96.52,0 2.54,0 0,2.54
VUSB
  Top 0.406: IC1.7 63.57,33.03 63.57,33.87 63.3,34.14 63.02,34.14 62.87,34.29 61.4,34.29 61.27,34.17 60.65,34.17 60.52,34.29 60.33,34.29 60.17,34.14 60.03,34.14 59.66,33.78 IC1.2 59.57,32.84 59.57,32 58.56,30.99 21.71,30.99 16.51,36.2 16.51,43.18
  Top 0.508: X2.1 9.22,30.81 9.53,31.11
  Top 1.016: 9.53,31.11 12.06,33.66 12.06,38.73 16.51,43.18 17.78,44.45 D1.A
XTAL1
  Top 0.406: IC1.16 70.65,37.94 71.44,37.15 R12.1 74.36,35.44 X1.P$1 77.08,34.56 C1.2

### Text on the board
bNames: 1 | BLK
tValues: GND | + | I2C_1 | I2C_2 | I2C_3 | I2C_4 | VDD | 3.3V | D5 | A0 | A1 | A2 | A3 | GND | D11 | D10 | D7 | GND | RX | TX | D6 | SIM800L | VDD | D12
tDocu: BeeMoS I2C master v1.1
bDocu: BeeMoS I2C master v1.1